# EAGLE schematic stm32hw03 (EAGLE 6.6.0)
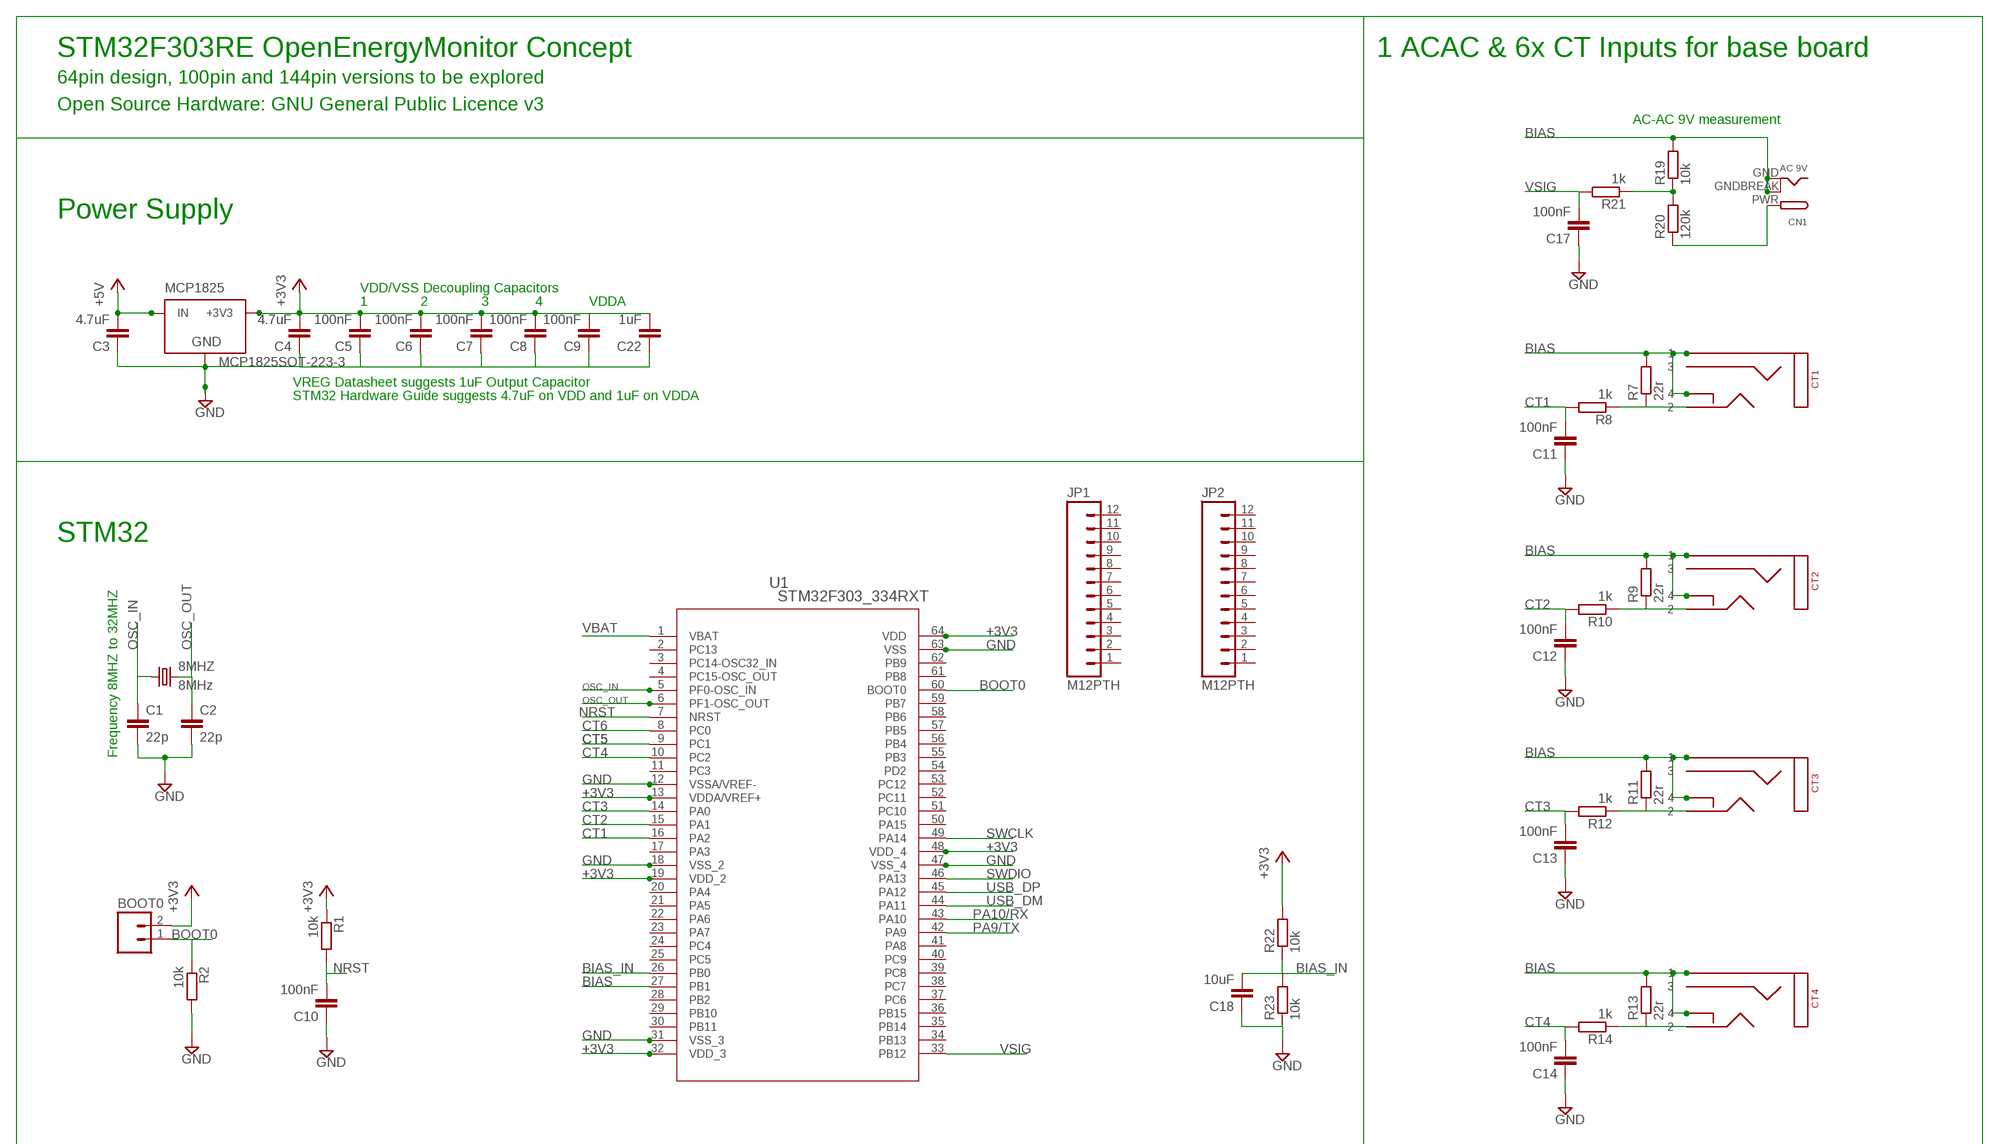
[diagram p0: schematic, sheet 1, part 1 of 2]
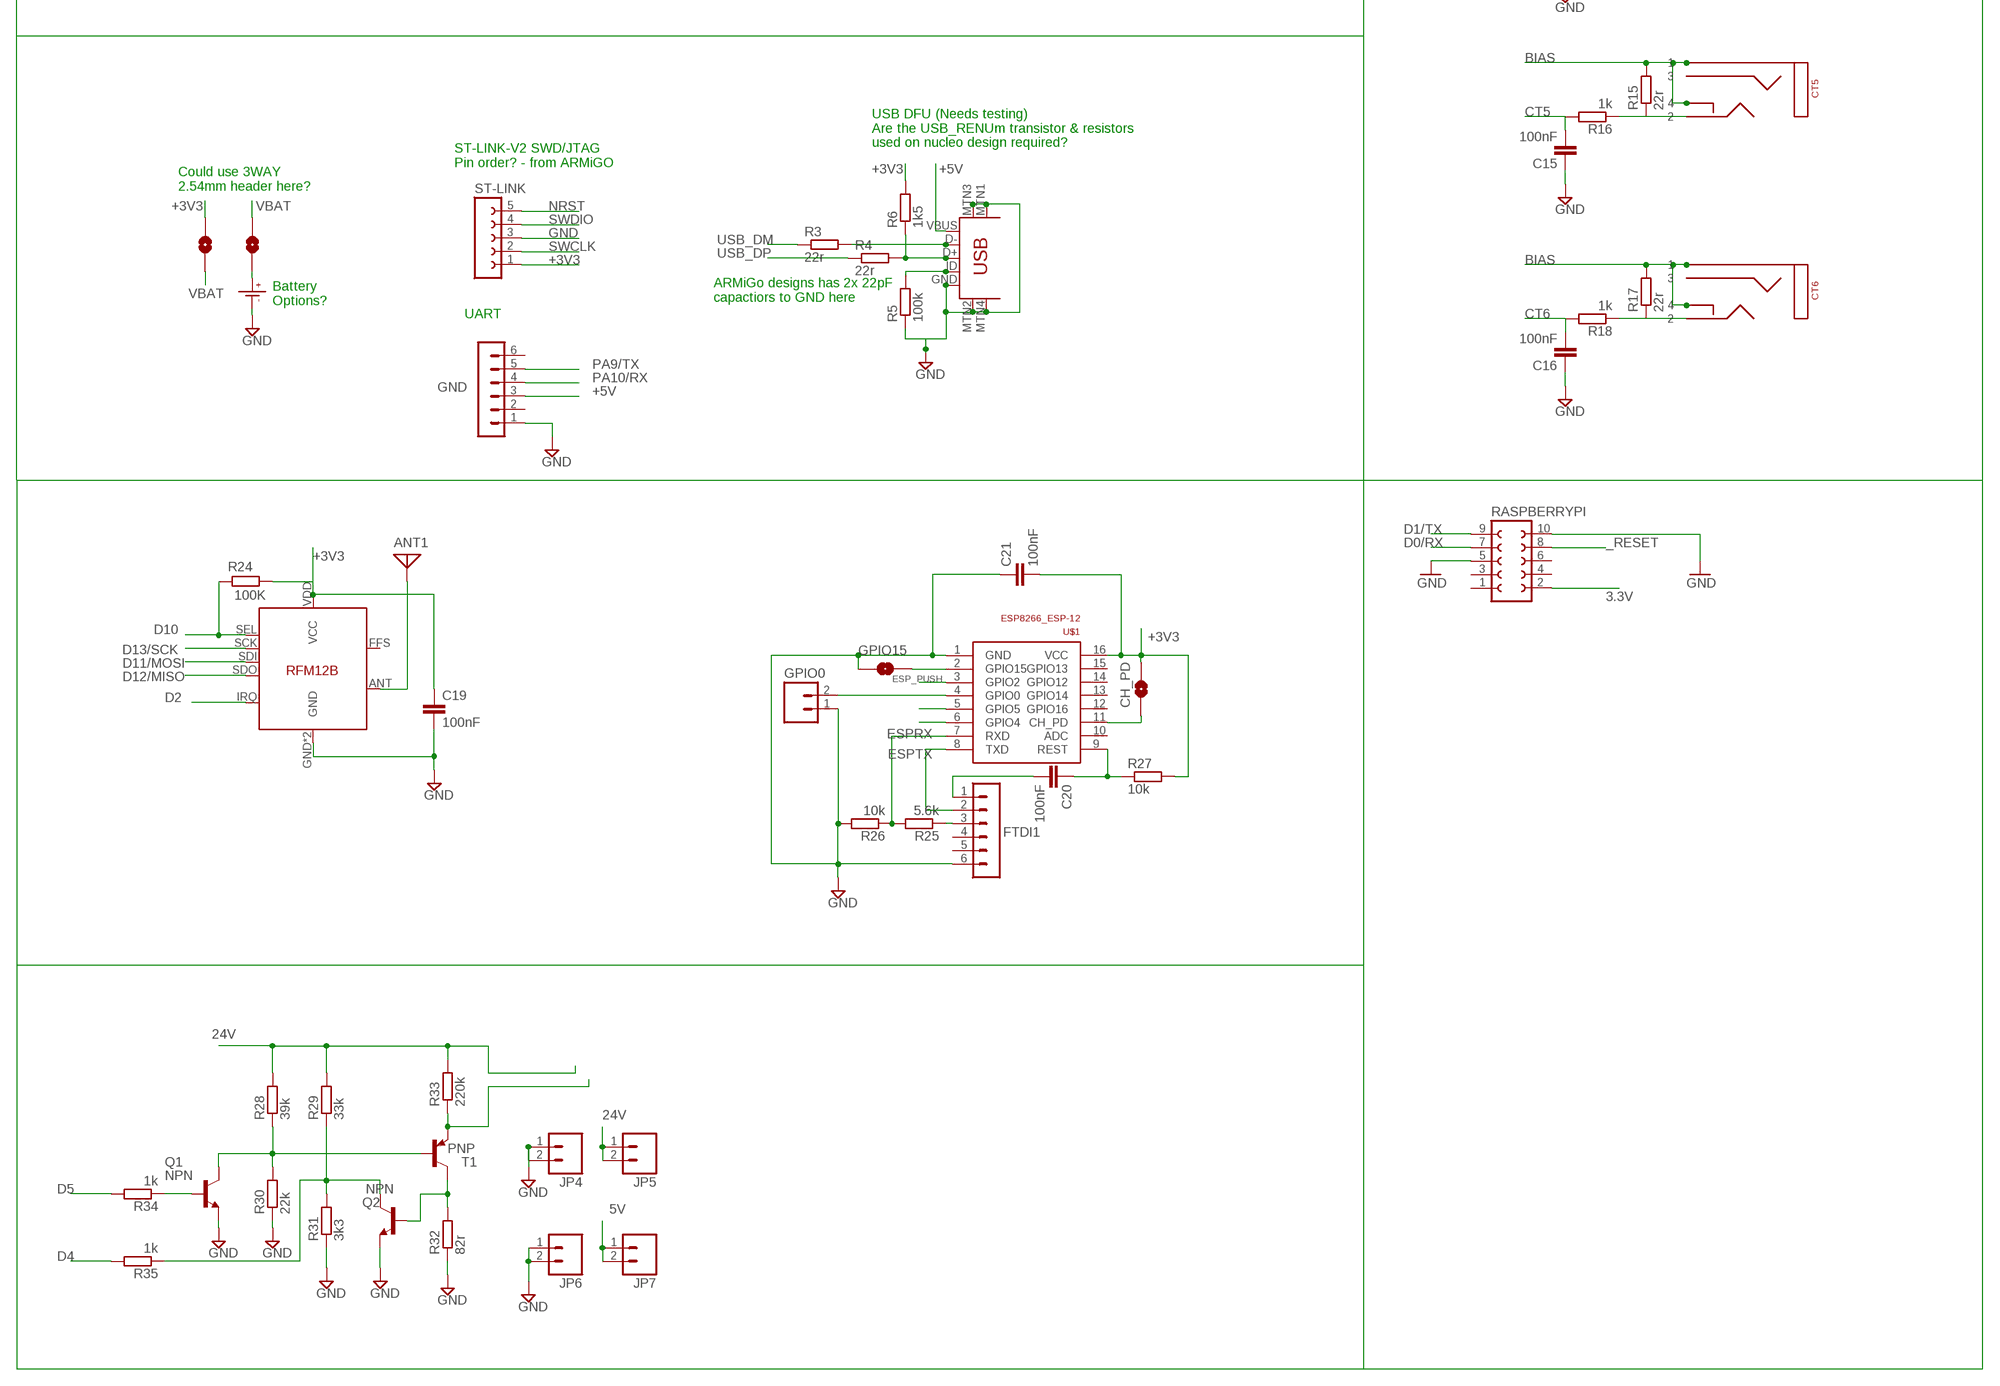
[diagram p1: schematic, sheet 1, part 2 of 2]

## Parts
3V3  SOLDERJUMPERNO  [SJ_2S-NO]
8MHZ  8MHz  CRYSTAL5X3  [CRYSTAL-SMD-5X3]
ANT1  ANTENNA  [PAD-01]
BATTERY  SOLDERJUMPERNO  [SJ_2S-NO]
BOOT0  M02PTH  [1X02]
C1  22p  C-EUC0603  [C0603]
C2  22p  C-EUC0603  [C0603]
C3  4.7uF  C-EUC0603  [C0603]
C4  4.7uF  C-EUC0603  [C0603]
C5  100nF  C-EUC0603  [C0603]
C6  100nF  C-EUC0603  [C0603]
C7  100nF  C-EUC0603  [C0603]
C8  100nF  C-EUC0603  [C0603]
C9  100nF  C-EUC0603  [C0603]
C10  100nF  C-EUC0603  [C0603]
C11  100nF  C-EUC0603  [C0603]
C12  100nF  C-EUC0603  [C0603]
C13  100nF  C-EUC0603  [C0603]
C14  100nF  C-EUC0603  [C0603]
C15  100nF  C-EUC0603  [C0603]
C16  100nF  C-EUC0603  [C0603]
C17  100nF  C-EUC0603  [C0603]
C18  10uF  C-EUC0603  [C0603]
C19  100nF  C-EUC0603  [C0603]
C20  100nF  C-EUC0603  [C0603]
C21  100nF  C-EUC0603  [C0603]
C22  1uF  C-EUC0603  [C0603]
CH_PD  SOLDERJUMPERNO  [SJ_2S-NO]
CN1  AC 9V  DCBARRELPTH  [DCJACK_2MM_PTH]
CR1220  CR1220SMD  [CR1220SMD]
CT1  STEREO_SMD  [STEREO_SMT]
CT2  STEREO_SMD  [STEREO_SMT]
CT3  STEREO_SMD  [STEREO_SMT]
CT4  STEREO_SMD  [STEREO_SMT]
CT5  STEREO_SMD  [STEREO_SMT]
CT6  STEREO_SMD  [STEREO_SMT]
FTDI1  FTDI  MA06-1  [MA06-1]
GND  UART  MA06-1  [MA06-1]
GPIO0  M02PTH  [1X02]
GPIO15  SOLDERJUMPERNO  [SJ_2S-NO]
JP1  M12PTH  [1X12]
JP2  M12PTH  [1X12]
JP4  M02PTH  [1X02]
JP5  M02PTH  [1X02]
JP6  M02PTH  [1X02]
JP7  M02PTH  [1X02]
MCP1825  MCP1825SOT-223-3  [SOT-223]
Q1  NPN  BC849SMD  [SOT23-BEC]
Q2  NPN  BC849SMD  [SOT23-BEC]
R1  10k  R-EU_R0603  [R0603]
R2  10k  R-EU_R0603  [R0603]
R3  22r  R-EU_R0603  [R0603]
R4  22r  R-EU_R0603  [R0603]
R5  100k  R-EU_R0603  [R0603]
R6  1k5  R-EU_R0603  [R0603]
R7  22r  R-EU_R0603  [R0603]
R8  1k  R-EU_R0603  [R0603]
R9  22r  R-EU_R0603  [R0603]
R10  1k  R-EU_R0603  [R0603]
R11  22r  R-EU_R0603  [R0603]
R12  1k  R-EU_R0603  [R0603]
R13  22r  R-EU_R0603  [R0603]
R14  1k  R-EU_R0603  [R0603]
R15  22r  R-EU_R0603  [R0603]
R16  1k  R-EU_R0603  [R0603]
R17  22r  R-EU_R0603  [R0603]
R18  1k  R-EU_R0603  [R0603]
R19  10k  R-EU_R0603  [R0603]
R20  120k  R-EU_R0603  [R0603]
R21  1k  R-EU_R0603  [R0603]
R22  10k  R-EU_R0603  [R0603]
R23  10k  R-EU_R0603  [R0603]
R24  100K  R-EU_R0603  [R0603]
R25  5.6k  R-EU_R0603  [R0603]
R26  10k  R-EU_R0603  [R0603]
R27  10k  R-EU_R0603  [R0603]
R28  39k  R-EU_R0603  [R0603]
R29  33k  R-EU_R0603  [R0603]
R30  22k  R-EU_R0603  [R0603]
R31  3k3  R-EU_R0603  [R0603]
R32  82r  R-EU_R0603  [R0603]
R33  220k  R-EU_R0603  [R0603]
R34  1k  R-EU_R0603  [R0603]
R35  1k  R-EU_R0603  [R0603]
RASPBERRYPI  FE05-2  [FE05-2]
ST-LINK  FE05-1  [FE05-1]
T1  PNP  BCX71SMD  [SOT23]
U1  STM32F303_334RXT  [LQFP64-10X10MM]
U$1  ESP8266_ESP-12  [ESP8266-ESP12]
U$10  USB-MINIB-5PIN  [USB-MINIB-CISECO]
U$14  RFM12B  [RFM12B]

## Nets
3.3V: RASPBERRYPI.2
5V [power]: JP7.1 JP7.2
24V: JP5.1 JP5.2 R28.2 R29.2 R33.2
+3V3: 3V3.1 BOOT0.2 C4.2 C5.2 C6.2 C7.2 C8.2 C9.2 C19.1 C21.2 C22.2 CH_PD.1 MCP1825.3(+3V3) R1.1 R6.2 R22.2 R24.1 R27.2 ST-LINK.1 U1.13(VDDA/VREF+) U1.19(VDD_2) U1.32(VDD_3) U1.48(VDD_4) U1.64(VDD) U$1.16(VCC) U$14.VDD(VCC)
+5V: C3.2 GND.3 MCP1825.1(IN) U$10.VBUS
_RESET: RASPBERRYPI.8
AC: CN1.PWR R20.1
ADC0: R19.1 R20.2 R21.1
BIAS: CN1.GND CN1.GNDBREAK CT1.P$1 CT1.P$4 CT2.P$1 CT2.P$4 CT3.P$1 CT3.P$4 CT4.P$1 CT4.P$4 CT5.P$1 CT5.P$4 CT6.P$1 CT6.P$4 R7.2 R9.2 R11.2 R13.2 R15.2 R17.2 R19.2 U1.27(PB1)
BIAS_IN: C18.2 R22.1 R23.2 U1.26(PB0)
BOOT0: BOOT0.1 R2.1 U1.60(BOOT0)
CT1: C11.2 R8.2 U1.16(PA2)
CT2: C12.2 R10.2 U1.15(PA1)
CT3: C13.2 R12.2 U1.14(PA0)
CT4: C14.2 R14.2 U1.10(PC2)
CT5: C15.2 R16.2 U1.9(PC1)
CT6: C16.2 R18.2 U1.8(PC0)
D0/RX: RASPBERRYPI.7
D1/TX: RASPBERRYPI.9
D2: U$14.IRQ
D4: R35.2
D5: R34.2
D10: R24.2 U$14.SEL
D11/MOSI: U$14.SDI
D12/MISO: U$14.SDO
D13/SCK: U$14.SCK
DIG1: ANT1.1 U$14.ANT
ESP_PUSH: U$1.3(GPIO2)
ESPRX: R25.2 R26.1 U$1.7(RXD)
ESPTX: FTDI1.2 U$1.8(TXD)
GND: C1.2 C2.2 C3.1 C4.1 C5.1 C6.1 C7.1 C8.1 C9.1 C10.1 C11.1 C12.1 C13.1 C14.1 C15.1 C16.1 C17.1 C18.1 C19.2 C21.1 C22.1 CR1220.P-(P$-) FTDI1.6 GND.1 GPIO0.1 GPIO15.2 JP4.1 JP4.2 JP6.1 JP6.2 MCP1825.2(GND) Q1.E Q2.E R2.2 R5.1 R23.1 R26.2 R30.1 R31.1 R32.1 RASPBERRYPI.5 RASPBERRYPI.10 ST-LINK.3 U1.12(VSSA/VREF-) U1.18(VSS_2) U1.31(VSS_3) U1.47(VSS_4) U1.63(VSS) U$1.1(GND) U$10.GND U$10.MTN1(MTN2) U$10.MTN2(MTN3) U$10.MTN3(MTN1) U$10.MTN4 U$14.GND U$14.P$12(GND)
N$1: BATTERY.2 CR1220.P+(P$+)
N$2: CT1.P$2 R7.1 R8.1
N$3: R5.2 U$10.ID
N$6: R4.2 R6.1 U$10.D+
N$7: R3.2 U$10.D-
N$8: CT2.P$2 R9.1 R10.1
N$9: C20.2 FTDI1.1
N$10: CT3.P$2 R11.1 R12.1
N$11: U$1.5(GPIO5)
N$12: CT4.P$2 R13.1 R14.1
N$13: R33.1 T1.2(E)
N$14: CT5.P$2 R15.1 R16.1
N$15: Q2.B R32.2 T1.3(C)
N$16: CT6.P$2 R17.1 R18.1
N$17: U$1.6(GPIO4)
N$18: Q1.C R28.1 R30.2 T1.1(B)
N$21: Q2.C R29.1 R31.2 R35.1
N$25: Q1.B R34.1
N$26: GPIO15.1 U$1.2(GPIO15)
N$29: GPIO0.2 U$1.4(GPIO0)
N$36: FTDI1.3 R25.1
N$39: CH_PD.2 U$1.11(CH_PD)
N$40: C20.1 R27.1 U$1.9(REST)
NRST: C10.2 R1.2 ST-LINK.5 U1.7(NRST)
OSC_IN: 8MHZ.1 C1.1 U1.5(PF0-OSC_IN)
OSC_OUT: 8MHZ.3 C2.1 U1.6(PF1-OSC_OUT)
PA9/TX: GND.5 U1.42(PA9)
PA10/RX: GND.4 U1.43(PA10)
SWCLK: ST-LINK.2 U1.49(PA14)
SWDIO: ST-LINK.4 U1.46(PA13)
USB_DM: R3.1 U1.44(PA11)
USB_DP: R4.1 U1.45(PA12)
VBAT: 3V3.2 BATTERY.1 U1.1(VBAT)
VSIG: C17.2 R21.2 U1.33(PB12)
Unconnected: CT1.P$3 CT2.P$3 CT3.P$3 CT4.P$3 CT5.P$3 CT6.P$3 FTDI1.4 FTDI1.5 GND.2 GND.6 JP1.1 JP1.2 JP1.3 JP1.4 JP1.5 JP1.6 JP1.7 JP1.8 JP1.9 JP1.10 JP1.11 JP1.12 JP2.1 JP2.2 JP2.3 JP2.4 JP2.5 JP2.6 JP2.7 JP2.8 JP2.9 JP2.10 JP2.11 JP2.12 RASPBERRYPI.1 RASPBERRYPI.3 RASPBERRYPI.4 RASPBERRYPI.6 U1.2(PC13) U1.3(PC14-OSC32_IN) U1.4(PC15-OSC_OUT) U1.11(PC3) U1.17(PA3) U1.20(PA4) U1.21(PA5) U1.22(PA6) U1.23(PA7) U1.24(PC4) U1.25(PC5) U1.28(PB2) U1.29(PB10) U1.30(PB11) U1.34(PB13) U1.35(PB14) U1.36(PB15) U1.37(PC6) U1.38(PC7) U1.39(PC8) U1.40(PC9) U1.41(PA8) U1.50(PA15) U1.51(PC10) U1.52(PC11) U1.53(PC12) U1.54(PD2) U1.55(PB3) U1.56(PB4) U1.57(PB5) U1.58(PB6) U1.59(PB7) U1.61(PB8) U1.62(PB9) U$1.10(ADC) U$1.12(GPIO16) U$1.13(GPIO14) U$1.14(GPIO12) U$1.15(GPIO13) U$14.FFS

## Notes on the sheet
- STM32F303RE OpenEnergyMonitor Concept | 1 ACAC & 6x CT Inputs for base board
- 64pin design, 100pin and 144pin versions to be explored
- Open Source Hardware: GNU General Public Licence v3
- AC-AC 9V measurement
- Power Supply
- VDD/VSS Decoupling Capacitors
- 1 | 2 | 3 | 4 | VDDA
- VREG Datasheet suggests 1uF Output Capacitor
- STM32 Hardware Guide suggests 4.7uF on VDD and 1uF on VDDA
- STM32
- Frequency 8MHZ to 32MHZ
- USB DFU (Needs testing)
  Are the USB_RENUm transistor & resistors 
  used on nucleo design required?
- ST-LINK-V2 SWD/JTAG
  Pin order? - from ARMiGO
- Could use 3WAY
  2.54mm header here?
- ARMiGo designs has 2x 22pF
  capactiors to GND here
- Battery
  Options?
- UART

## Library data of the parts
3V3 BATTERY CH_PD GPIO15 = SparkFun:SOLDERJUMPER: Solder Jumper Standard SMD solder jumper. Used to automate production. Two varients : Normally Open and Normally Closed are the same, but have different paste layers. NC will have a large amount of paste and should jumper during reflow.
8MHZ = SparkFun:CRYSTAL: Crystals Various standard crystals. Proven footprints. Spark Fun Electronics SKU : COM-00534
ANT1 = discrete:ANTENNA: Antenna
BOOT0 GPIO0 JP4-JP7 = SparkFun:M02: Header 2 Standard 2-pin 0.1" header. Use with straight break away headers (SKU : PRT-00116), right angle break away headers (PRT-00553), swiss pins (PRT-00743), machine pins (PRT-00117), and female headers (PRT-00115). Molex polarized connector foot print use with SKU : PRT-08233 with associated crimp pins and housings.
C1-C22 = resistor:C-EU: CAPACITOR, European symbol
CN1 = adafruit:DCBARREL: 2.0mm DC Barrel Jack DCJACK_2MM_PTH - Through Hole Jack (4UConnector: 05537)
CR1220 = IotaWatt_parts:CR1220SMD: CR1220 Battery SMD; MPN: Harwin S8411-45R
CT1-CT6 = IotaWatt_parts:STEREO_SMD: 3.5mm Stereo Jack SMT
FTDI1 GND = JeeLabs:MA06-1: PIN HEADER
JP1 JP2 = SparkFun:M12: Header 12 Standard 12-pin 0.1" header. Use with straight break away headers (SKU : PRT-00116), right angle break away headers (PRT-00553), swiss pins (PRT-00743), machine pins (PRT-00117), and female headers (PRT-00115).
MCP1825 = SteelCaveRobotics-Power:MCP1825: MCP1825 3.3v LDO Linear Regulator
Q1 Q2 = transistor-npn:BC849*: NPN Transistor
R1-R35 = resistor:R-EU_: RESISTOR, European symbol
RASPBERRYPI = con-lsta:FE05-2: FEMALE HEADER; OC_FARNELL: unknown; OC_NEWARK: unknown
ST-LINK = con-lsta:FE05-1: FEMALE HEADER; OC_FARNELL: unknown; OC_NEWARK: unknown
T1 = transistor-pnp:BCX71SMD: PNP Transistor
U1 = stm32f303:STM32F303_334RXT; MANUFACTURER_PART_NUMBER: stm32f303_334rxt; VENDOR: STMicroelectronics
U$1 = ESP8266-ESP12:ESP8266_ESP-12
U$10 = Ciseco USB miniB_Updated:USB-MINIB: Mini-USB "B" connector with 5th pin broken out. Created new symbol breaking out 5th "ID" pin in mini/micro USB connector spec. See: http://en.wikipedia.org/wiki/Mini_usb#Cables. Uses same footprint as 4-pin symbol. Also added pins to connect to mounting / shield pads if required (probably not generally needed as signals aren't shielded once they leave the connector). Modified by Ciseco for Rapid Part 24-0357
U$14 = JeeParts:RFM12B

## Net classes
0 default: width 0.203 mm, drill 0.6 mm, clearance 0.203 mm
1 power: width 0.381 mm, drill 0.6 mm, clearance 0.254 mm
2 gnd: width 0.254 mm, drill 0.6 mm, clearance 0.254 mm